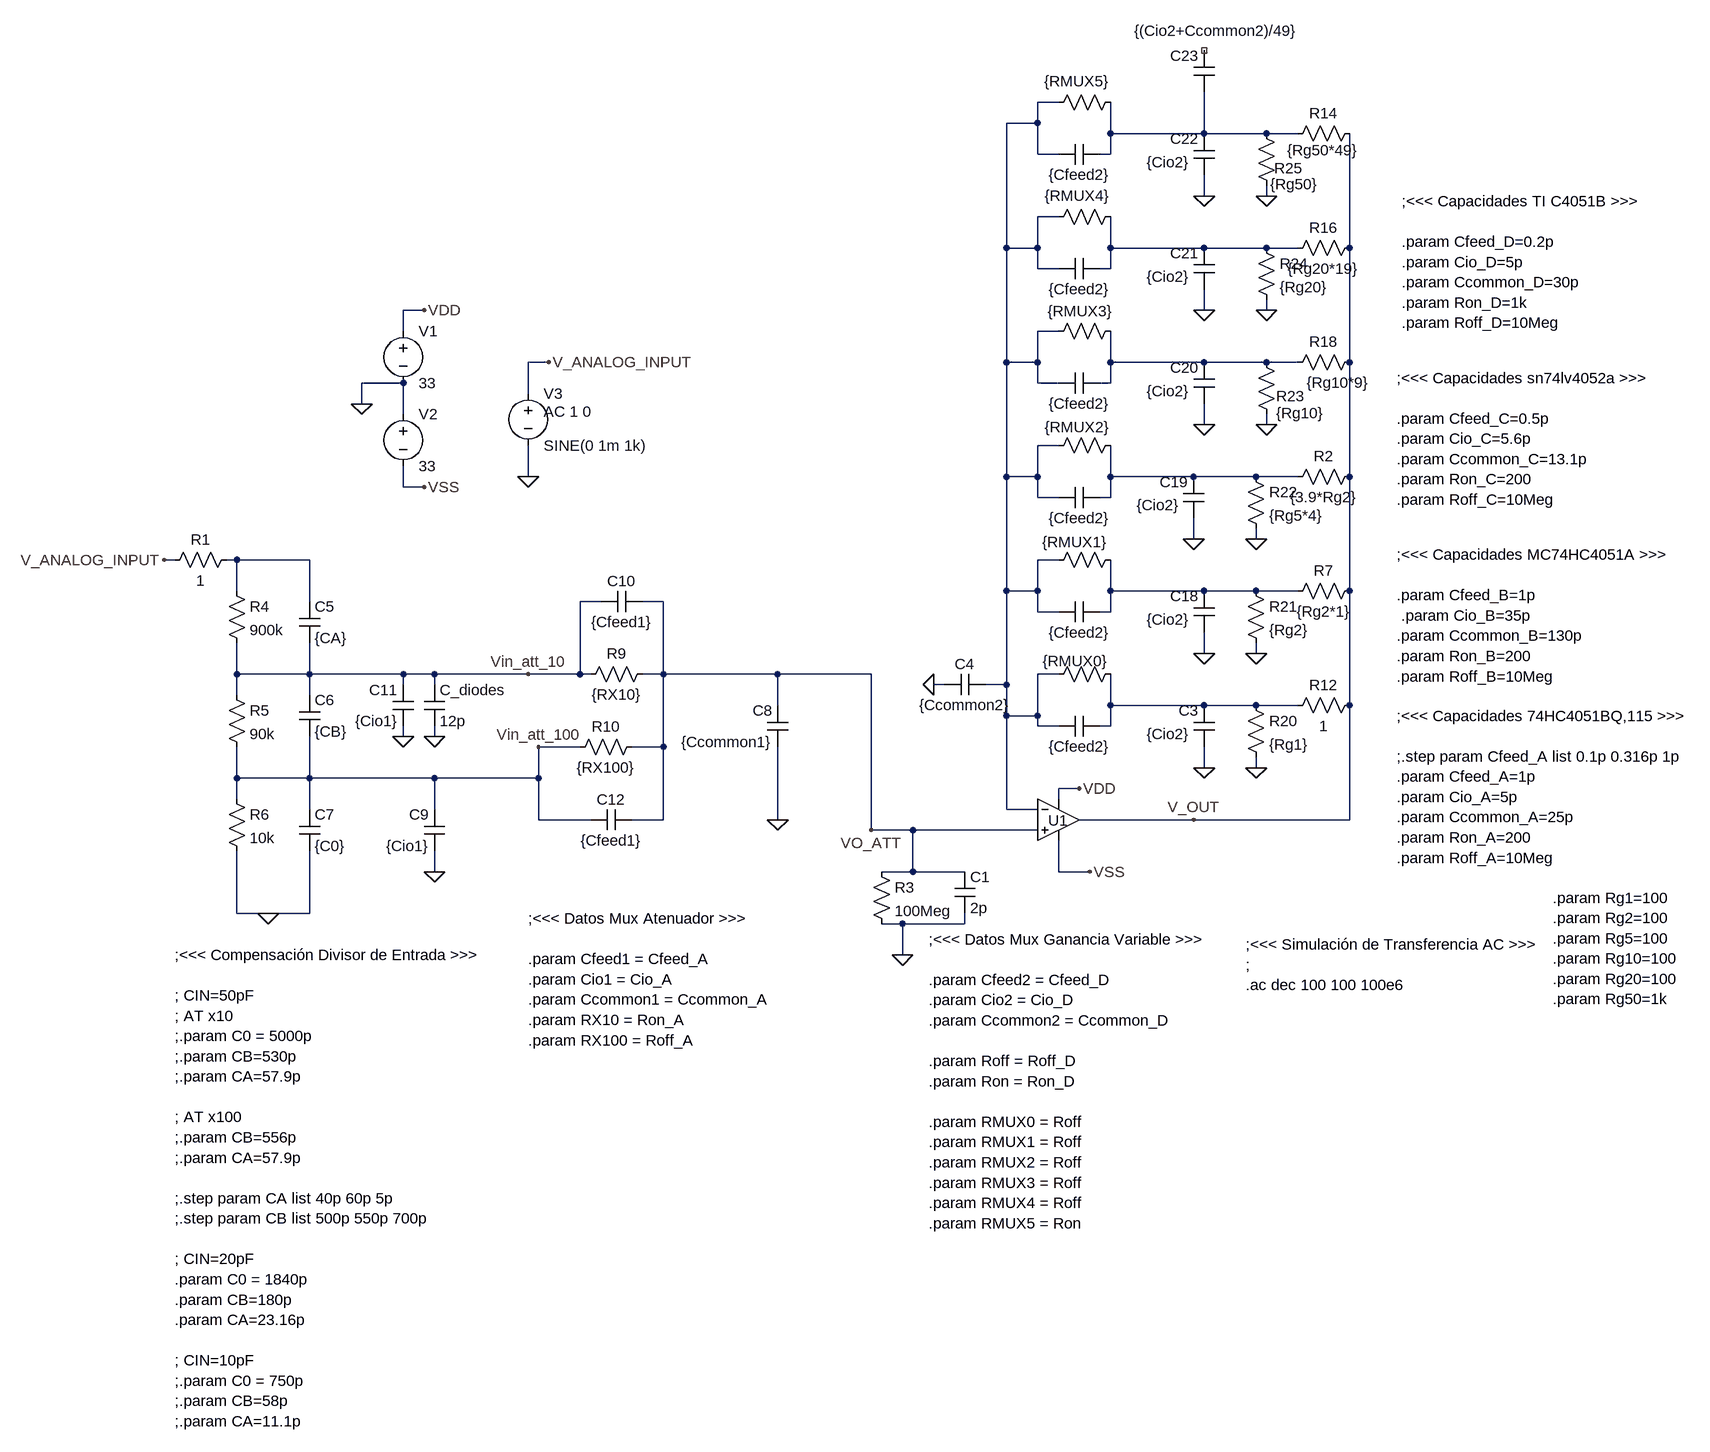
[diagram p0: schematic mux_sim_B.asc]
mux_sim_B.asc, the LTspice schematic file:
Version 4
SHEET 1 1156 1428
WIRE -32 -544 -64 -544
WIRE -64 -512 -64 -544
WIRE -64 -512 -112 -512
WIRE 48 -496 48 -544
WIRE 192 -496 192 -560
WIRE 192 -496 48 -496
WIRE 288 -496 192 -496
WIRE 336 -496 288 -496
WIRE -64 -464 -64 -512
WIRE -32 -464 -64 -464
WIRE 48 -464 48 -496
WIRE 48 -464 32 -464
WIRE 192 -400 192 -432
WIRE 288 -400 288 -416
WIRE -32 -368 -64 -368
WIRE -112 -320 -112 -512
WIRE -64 -320 -64 -368
WIRE -64 -320 -112 -320
WIRE 48 -320 48 -368
WIRE 192 -320 48 -320
WIRE 288 -320 192 -320
WIRE 336 -320 288 -320
WIRE 416 -320 416 -496
WIRE -64 -288 -64 -320
WIRE -32 -288 -64 -288
WIRE 48 -288 48 -320
WIRE 48 -288 32 -288
WIRE -1008 -224 -1040 -224
WIRE 192 -224 192 -256
WIRE 288 -224 288 -240
WIRE -1040 -192 -1040 -224
WIRE -32 -192 -64 -192
WIRE -816 -144 -848 -144
WIRE -112 -144 -112 -320
WIRE -64 -144 -64 -192
WIRE -64 -144 -112 -144
WIRE 48 -144 48 -192
WIRE 192 -144 48 -144
WIRE 288 -144 192 -144
WIRE 336 -144 288 -144
WIRE 416 -144 416 -320
WIRE -1040 -112 -1104 -112
WIRE -64 -112 -64 -144
WIRE -32 -112 -64 -112
WIRE 48 -112 48 -144
WIRE 48 -112 32 -112
WIRE -848 -96 -848 -144
WIRE -1104 -80 -1104 -112
WIRE -1040 -64 -1040 -112
WIRE 192 -48 192 -80
WIRE 288 -48 288 -64
WIRE -32 -16 -64 -16
WIRE -848 32 -848 -16
WIRE -112 32 -112 -144
WIRE -64 32 -64 -16
WIRE -64 32 -112 32
WIRE 48 32 48 -16
WIRE 176 32 48 32
WIRE 272 32 176 32
WIRE 336 32 272 32
WIRE 416 32 416 -144
WIRE -1040 48 -1040 16
WIRE -1008 48 -1040 48
WIRE -64 64 -64 32
WIRE -32 64 -64 64
WIRE 48 64 48 32
WIRE 48 64 32 64
WIRE 176 128 176 96
WIRE 272 128 272 112
WIRE -1392 160 -1408 160
WIRE -1296 160 -1312 160
WIRE -1184 160 -1296 160
WIRE -32 160 -64 160
WIRE -1296 208 -1296 160
WIRE -112 208 -112 32
WIRE -64 208 -64 160
WIRE -64 208 -112 208
WIRE 48 208 48 160
WIRE 192 208 48 208
WIRE 272 208 192 208
WIRE 336 208 272 208
WIRE 416 208 416 32
WIRE -1184 224 -1184 160
WIRE -736 224 -768 224
WIRE -640 224 -672 224
WIRE -64 240 -64 208
WIRE -32 240 -64 240
WIRE 48 240 48 208
WIRE 48 240 32 240
WIRE 192 304 192 272
WIRE 272 304 272 288
WIRE -1296 336 -1296 288
WIRE -1184 336 -1184 288
WIRE -1184 336 -1296 336
WIRE -1040 336 -1184 336
WIRE -992 336 -1040 336
WIRE -848 336 -992 336
WIRE -768 336 -768 224
WIRE -768 336 -848 336
WIRE -752 336 -768 336
WIRE -640 336 -640 224
WIRE -640 336 -672 336
WIRE -464 336 -640 336
WIRE -320 336 -464 336
WIRE -32 336 -64 336
WIRE -1040 352 -1040 336
WIRE -992 352 -992 336
WIRE -208 352 -224 352
WIRE -112 352 -112 208
WIRE -112 352 -144 352
WIRE -1296 368 -1296 336
WIRE -1184 368 -1184 336
WIRE -464 384 -464 336
WIRE 48 384 48 336
WIRE 192 384 48 384
WIRE 272 384 192 384
WIRE 336 384 272 384
WIRE 416 384 416 208
WIRE -112 400 -112 352
WIRE -64 400 -64 336
WIRE -64 400 -112 400
WIRE -64 416 -64 400
WIRE -32 416 -64 416
WIRE 48 416 48 384
WIRE 48 416 32 416
WIRE -1040 432 -1040 416
WIRE -992 432 -992 416
WIRE -768 448 -832 448
WIRE -640 448 -640 336
WIRE -640 448 -688 448
WIRE 192 480 192 448
WIRE 272 480 272 464
WIRE -1296 496 -1296 448
WIRE -1184 496 -1184 432
WIRE -1184 496 -1296 496
WIRE -992 496 -1184 496
WIRE -832 496 -832 448
WIRE -832 496 -992 496
WIRE 0 512 -32 512
WIRE -1296 528 -1296 496
WIRE -32 528 -32 512
WIRE -1184 544 -1184 496
WIRE -992 544 -992 496
WIRE -112 544 -112 400
WIRE -64 544 -112 544
WIRE -832 560 -832 496
WIRE -752 560 -832 560
WIRE -640 560 -640 448
WIRE -640 560 -688 560
WIRE -464 560 -464 448
WIRE 176 560 0 560
WIRE 416 560 416 384
WIRE 416 560 176 560
WIRE -320 576 -320 336
WIRE -256 576 -320 576
WIRE -64 576 -256 576
WIRE -992 640 -992 608
WIRE -256 640 -256 576
WIRE -256 640 -304 640
WIRE -176 640 -256 640
WIRE -32 640 -32 592
WIRE 16 640 -32 640
WIRE -1296 704 -1296 608
WIRE -1248 704 -1296 704
WIRE -1184 704 -1184 608
WIRE -1184 704 -1248 704
WIRE -272 720 -304 720
WIRE -176 720 -176 704
WIRE -176 720 -272 720
WIRE -272 768 -272 720
FLAG 16 640 VSS
FLAG -272 768 0
FLAG 272 480 0
FLAG 0 512 VDD
FLAG -1104 -80 0
FLAG -1008 -224 VDD
FLAG -1008 48 VSS
FLAG -816 -144 V_ANALOG_INPUT
FLAG -848 32 0
FLAG 176 560 V_OUT
FLAG -224 352 0
FLAG 192 480 0
FLAG -1248 704 0
FLAG -1408 160 V_ANALOG_INPUT
FLAG -464 560 0
FLAG -1040 432 0
FLAG -848 336 Vin_att_10
FLAG -832 448 Vin_att_100
FLAG -992 640 0
FLAG -320 576 VO_ATT
FLAG -992 432 0
FLAG 272 304 0
FLAG 272 128 0
FLAG 288 -48 0
FLAG 288 -224 0
FLAG 288 -400 0
FLAG 192 304 0
FLAG 176 128 0
FLAG 192 -48 0
FLAG 192 -224 0
FLAG 192 -400 0
SYMBOL res 432 16 R90
WINDOW 0 0 56 VBottom 2
WINDOW 3 32 56 VTop 2
SYMATTR InstName R2
SYMATTR Value {3.9*Rg2}
SYMBOL cap -192 640 R0
SYMATTR InstName C1
SYMATTR Value 2p
SYMBOL res -320 624 R0
SYMATTR InstName R3
SYMATTR Value 100Meg
SYMBOL voltage -1040 -208 R0
WINDOW 123 0 0 Left 2
WINDOW 39 0 0 Left 2
SYMATTR InstName V1
SYMATTR Value 33
SYMBOL voltage -1040 -80 R0
WINDOW 123 0 0 Left 2
WINDOW 39 0 0 Left 2
SYMATTR InstName V2
SYMATTR Value 33
SYMBOL voltage -848 -112 R0
WINDOW 123 24 44 Left 2
WINDOW 39 0 0 Left 2
SYMATTR Value2 AC 1 0
SYMATTR InstName V3
SYMATTR Value SINE(0 1m 1k)
SYMBOL Opamps\\UniversalOpamp2 -32 560 R0
WINDOW 0 -16 1 Left 2
SYMATTR InstName U1
SYMATTR Value2 Avol=40k GBW=250Meg Slew=100Meg
SYMBOL cap 32 48 R90
WINDOW 0 0 32 Invisible 2
WINDOW 3 32 32 VTop 2
SYMATTR InstName C2
SYMATTR Value {Cfeed2}
SYMBOL cap -144 336 R90
WINDOW 0 0 32 VBottom 2
WINDOW 3 32 32 VTop 2
SYMATTR InstName C4
SYMATTR Value {Ccommon2}
SYMBOL cap 208 448 R180
WINDOW 0 24 56 Left 2
WINDOW 3 38 20 Left 2
SYMATTR InstName C3
SYMATTR Value {Cio2}
SYMBOL res -1312 192 R0
SYMATTR InstName R4
SYMATTR Value 900k
SYMBOL res -1312 352 R0
SYMATTR InstName R5
SYMATTR Value 90k
SYMBOL res -1312 512 R0
SYMATTR InstName R6
SYMATTR Value 10k
SYMBOL cap -1200 224 R0
SYMATTR InstName C5
SYMATTR Value {CA}
SYMBOL cap -1200 368 R0
SYMATTR InstName C6
SYMATTR Value {CB}
SYMBOL cap -1200 544 R0
SYMATTR InstName C7
SYMATTR Value {C0}
SYMBOL res 64 -32 R90
WINDOW 0 0 56 Invisible 2
WINDOW 3 -28 67 VTop 2
SYMATTR InstName R8
SYMATTR Value {RMUX2}
SYMBOL cap -448 448 R180
WINDOW 0 24 56 Left 2
WINDOW 3 24 8 Left 2
SYMATTR InstName C8
SYMATTR Value {Ccommon1}
SYMBOL cap -672 208 R90
WINDOW 0 0 32 VBottom 2
WINDOW 3 32 32 VTop 2
SYMATTR InstName C10
SYMATTR Value {Cfeed1}
SYMBOL cap -1024 416 R180
WINDOW 0 24 56 Left 2
WINDOW 3 24 8 Left 2
SYMATTR InstName C11
SYMATTR Value {Cio1}
SYMBOL cap -976 608 R180
WINDOW 0 24 56 Left 2
WINDOW 3 24 8 Left 2
SYMATTR InstName C9
SYMATTR Value {Cio1}
SYMBOL res -656 320 R90
WINDOW 0 0 56 VBottom 2
WINDOW 3 32 56 VTop 2
SYMATTR InstName R9
SYMATTR Value {RX10}
SYMBOL res -672 432 R90
WINDOW 0 0 56 VBottom 2
WINDOW 3 32 56 VTop 2
SYMATTR InstName R10
SYMATTR Value {RX100}
SYMBOL cap -688 544 R90
WINDOW 0 0 32 VBottom 2
WINDOW 3 32 32 VTop 2
SYMATTR InstName C12
SYMATTR Value {Cfeed1}
SYMBOL res 432 192 R90
WINDOW 0 0 56 VBottom 2
WINDOW 3 32 56 VTop 2
SYMATTR InstName R7
SYMATTR Value {Rg2*1}
SYMBOL cap 32 224 R90
WINDOW 0 0 32 Invisible 2
WINDOW 3 32 32 VTop 2
SYMATTR InstName C13
SYMATTR Value {Cfeed2}
SYMBOL res 64 144 R90
WINDOW 0 0 56 Invisible 2
WINDOW 3 -27 71 VTop 2
SYMATTR InstName R11
SYMATTR Value {RMUX1}
SYMBOL res 432 368 R90
WINDOW 0 0 56 VBottom 2
WINDOW 3 32 56 VTop 2
SYMATTR InstName R12
SYMATTR Value 1
SYMBOL cap 32 400 R90
WINDOW 0 0 32 Invisible 2
WINDOW 3 32 32 VTop 2
SYMATTR InstName C14
SYMATTR Value {Cfeed2}
SYMBOL res 64 320 R90
WINDOW 0 0 56 Invisible 2
WINDOW 3 -20 70 VTop 2
SYMATTR InstName R13
SYMATTR Value {RMUX0}
SYMBOL res 432 -512 R90
WINDOW 0 0 56 VBottom 2
WINDOW 3 26 57 VTop 2
SYMATTR InstName R14
SYMATTR Value {Rg50*49}
SYMBOL cap 32 -480 R90
WINDOW 0 0 32 Invisible 2
WINDOW 3 32 32 VTop 2
SYMATTR InstName C15
SYMATTR Value {Cfeed2}
SYMBOL res 64 -560 R90
WINDOW 0 0 56 Invisible 2
WINDOW 3 -32 68 VTop 2
SYMATTR InstName R15
SYMATTR Value {RMUX5}
SYMBOL res 432 -336 R90
WINDOW 0 0 56 VBottom 2
WINDOW 3 32 56 VTop 2
SYMATTR InstName R16
SYMATTR Value {Rg20*19}
SYMBOL cap 32 -304 R90
WINDOW 0 0 32 Invisible 2
WINDOW 3 32 32 VTop 2
SYMATTR InstName C16
SYMATTR Value {Cfeed2}
SYMBOL res 64 -384 R90
WINDOW 0 0 56 Invisible 2
WINDOW 3 -32 67 VTop 2
SYMATTR InstName R17
SYMATTR Value {RMUX4}
SYMBOL res 432 -160 R90
WINDOW 0 0 56 VBottom 2
WINDOW 3 32 34 VTop 2
SYMATTR InstName R18
SYMATTR Value {Rg10*9}
SYMBOL cap 32 -128 R90
WINDOW 0 0 32 Invisible 2
WINDOW 3 32 32 VTop 2
SYMATTR InstName C17
SYMATTR Value {Cfeed2}
SYMBOL res 64 -208 R90
WINDOW 0 0 56 Invisible 2
WINDOW 3 -30 62 VTop 2
SYMATTR InstName R19
SYMATTR Value {RMUX3}
SYMBOL cap -1008 352 R0
SYMATTR InstName C_diodes
SYMATTR Value 12p
SYMBOL res 256 368 R0
SYMATTR InstName R20
SYMATTR Value {Rg1}
SYMBOL res 256 192 R0
SYMATTR InstName R21
SYMATTR Value {Rg2}
SYMBOL res 256 16 R0
SYMATTR InstName R22
SYMATTR Value {Rg5*4}
SYMBOL res 272 -160 R0
WINDOW 0 31 68 Left 2
WINDOW 3 31 94 Left 2
SYMATTR InstName R23
SYMATTR Value {Rg10}
SYMBOL res 272 -336 R0
SYMATTR InstName R24
SYMATTR Value {Rg20}
SYMBOL res 272 -512 R0
WINDOW 0 28 69 Left 2
WINDOW 3 22 94 Left 2
SYMATTR InstName R25
SYMATTR Value {Rg50}
SYMBOL cap 208 272 R180
WINDOW 0 24 56 Left 2
WINDOW 3 38 20 Left 2
SYMATTR InstName C18
SYMATTR Value {Cio2}
SYMBOL cap 192 96 R180
WINDOW 0 24 56 Left 2
WINDOW 3 38 20 Left 2
SYMATTR InstName C19
SYMATTR Value {Cio2}
SYMBOL cap 208 -80 R180
WINDOW 0 24 56 Left 2
WINDOW 3 38 20 Left 2
SYMATTR InstName C20
SYMATTR Value {Cio2}
SYMBOL cap 208 -256 R180
WINDOW 0 24 56 Left 2
WINDOW 3 38 20 Left 2
SYMATTR InstName C21
SYMATTR Value {Cio2}
SYMBOL cap 208 -432 R180
WINDOW 0 24 56 Left 2
WINDOW 3 38 20 Left 2
SYMATTR InstName C22
SYMATTR Value {Cio2}
SYMBOL cap 208 -560 R180
WINDOW 0 24 56 Left 2
WINDOW 3 -131 94 Left 2
SYMATTR InstName C23
SYMATTR Value {(Cio2+Ccommon2)/49}
SYMBOL res -1296 144 R90
WINDOW 0 0 56 VBottom 2
WINDOW 3 32 56 VTop 2
SYMATTR InstName R1
SYMATTR Value 1
TEXT 488 -120 Left 2 !;<<< Capacidades sn74lv4052a >>>\n \n.param Cfeed_C=0.5p\n.param Cio_C=5.6p\n.param Ccommon_C=13.1p\n.param Ron_C=200\n.param Roff_C=10Meg
TEXT -848 712 Left 2 !;<<< Datos Mux Atenuador >>>\n \n.param Cfeed1 = Cfeed_A\n.param Cio1 = Cio_A\n.param Ccommon1 = Ccommon_A\n.param RX10 = Ron_A\n.param RX100 = Roff_A
TEXT 488 152 Left 2 !;<<< Capacidades MC74HC4051A >>>\n \n.param Cfeed_B=1p\n .param Cio_B=35p\n.param Ccommon_B=130p\n.param Ron_B=200\n.param Roff_B=10Meg
TEXT -232 744 Left 2 !;<<< Datos Mux Ganancia Variable >>>\n \n.param Cfeed2 = Cfeed_D\n.param Cio2 = Cio_D\n.param Ccommon2 = Ccommon_D\n \n.param Roff = Roff_D\n.param Ron = Ron_D \n \n.param RMUX0 = Roff\n.param RMUX1 = Roff\n.param RMUX2 = Roff\n.param RMUX3 = Roff\n.param RMUX4 = Roff\n.param RMUX5 = Ron
TEXT 256 752 Left 2 !;<<< Simulación de Transferencia AC >>>\n;\n.ac dec 100 100 100e6
TEXT 488 400 Left 2 !;<<< Capacidades 74HC4051BQ,115 >>>\n \n;.step param Cfeed_A list 0.1p 0.316p 1p\n.param Cfeed_A=1p\n.param Cio_A=5p\n.param Ccommon_A=25p\n.param Ron_A=200\n.param Roff_A=10Meg
TEXT 496 -392 Left 2 !;<<< Capacidades TI C4051B >>>\n \n.param Cfeed_D=0.2p\n.param Cio_D=5p\n.param Ccommon_D=30p\n.param Ron_D=1k\n.param Roff_D=10Meg
TEXT 728 680 Left 2 !.param Rg1=100\n.param Rg2=100\n.param Rg5=100\n.param Rg10=100\n.param Rg20=100\n.param Rg50=1k
TEXT -1392 768 Left 2 !;<<< Compensación Divisor de Entrada >>>\n \n; CIN=50pF\n; AT x10\n;.param C0 = 5000p\n;.param CB=530p\n;.param CA=57.9p\n \n; AT x100\n;.param CB=556p\n;.param CA=57.9p\n \n;.step param CA list 40p 60p 5p\n;.step param CB list 500p 550p 700p\n \n; CIN=20pF\n.param C0 = 1840p\n.param CB=180p\n.param CA=23.16p\n \n; CIN=10pF\n;.param C0 = 750p\n;.param CB=58p\n;.param CA=11.1p

The netlist it stands for:
* mux_sim_B.asc
R2 V_OUT N005 {3.9*Rg2}
C1 VO_ATT 0 2p
R3 VO_ATT 0 100Meg
V1 VDD 0 33
V2 0 VSS 33
V3 V_ANALOG_INPUT 0 SINE(0 1m 1k) AC 1 0
XU1 VO_ATT N001 VDD VSS V_OUT level.2 Avol=40k GBW=250Meg Slew=100Meg ilimit=25m rail=0 Vos=0 phimargin=45 en=0 enk=0 in=0 ink=0 Rin=500Meg  ; pins IN+ IN- V+ V- OUT
C2 N005 N001 {Cfeed2}
C4 N001 0 {Ccommon2}
C3 0 N008 {Cio2}
R4 N006 Vin_att_10 900k
R5 Vin_att_10 Vin_att_100 90k
R6 Vin_att_100 0 10k
C5 N006 Vin_att_10 {CA}
C6 Vin_att_10 Vin_att_100 {CB}
C7 Vin_att_100 0 {C0}
R8 N005 N001 {RMUX2}
C8 0 VO_ATT {Ccommon1}
C10 VO_ATT Vin_att_10 {Cfeed1}
C11 0 Vin_att_10 {Cio1}
C9 0 Vin_att_100 {Cio1}
R9 VO_ATT Vin_att_10 {RX10}
R10 VO_ATT Vin_att_100 {RX100}
C12 VO_ATT Vin_att_100 {Cfeed1}
R7 V_OUT N007 {Rg2*1}
C13 N007 N001 {Cfeed2}
R11 N007 N001 {RMUX1}
R12 V_OUT N008 1
C14 N008 N001 {Cfeed2}
R13 N008 N001 {RMUX0}
R14 V_OUT N002 {Rg50*49}
C15 N002 N001 {Cfeed2}
R15 N002 N001 {RMUX5}
R16 V_OUT N003 {Rg20*19}
C16 N003 N001 {Cfeed2}
R17 N003 N001 {RMUX4}
R18 V_OUT N004 {Rg10*9}
C17 N004 N001 {Cfeed2}
R19 N004 N001 {RMUX3}
C_diodes Vin_att_10 0 12p
R20 N008 0 {Rg1}
R21 N007 0 {Rg2}
R22 N005 0 {Rg5*4}
R23 N004 0 {Rg10}
R24 N003 0 {Rg20}
R25 N002 0 {Rg50}
C18 0 N007 {Cio2}
C19 0 N005 {Cio2}
C20 0 N004 {Cio2}
C21 0 N003 {Cio2}
C22 0 N002 {Cio2}
C23 N002 NC_01 {(Cio2+Ccommon2)/49}
R1 N006 V_ANALOG_INPUT 1
;<<< Capacidades sn74lv4052a >>>
.param Cfeed_C=0.5p
.param Cio_C=5.6p
.param Ccommon_C=13.1p
.param Ron_C=200
.param Roff_C=10Meg
;<<< Datos Mux Atenuador >>>
.param Cfeed1 = Cfeed_A
.param Cio1 = Cio_A
.param Ccommon1 = Ccommon_A
.param RX10 = Ron_A
.param RX100 = Roff_A
;<<< Capacidades MC74HC4051A >>>
.param Cfeed_B=1p
 .param Cio_B=35p
.param Ccommon_B=130p
.param Ron_B=200
.param Roff_B=10Meg
;<<< Datos Mux Ganancia Variable >>>
.param Cfeed2 = Cfeed_D
.param Cio2 = Cio_D
.param Ccommon2 = Ccommon_D
.param Roff = Roff_D
.param Ron = Ron_D
.param RMUX0 = Roff
.param RMUX1 = Roff
.param RMUX2 = Roff
.param RMUX3 = Roff
.param RMUX4 = Roff
.param RMUX5 = Ron
;<<< Simulación de Transferencia AC >>>
;
.ac dec 100 100 100e6
;<<< Capacidades 74HC4051BQ,115 >>>
;.step param Cfeed_A list 0.1p 0.316p 1p
.param Cfeed_A=1p
.param Cio_A=5p
.param Ccommon_A=25p
.param Ron_A=200
.param Roff_A=10Meg
;<<< Capacidades TI C4051B >>>
.param Cfeed_D=0.2p
.param Cio_D=5p
.param Ccommon_D=30p
.param Ron_D=1k
.param Roff_D=10Meg
.param Rg1=100
.param Rg2=100
.param Rg5=100
.param Rg10=100
.param Rg20=100
.param Rg50=1k
;<<< Compensación Divisor de Entrada >>>
; CIN=50pF
; AT x10
;.param C0 = 5000p
;.param CB=530p
;.param CA=57.9p
; AT x100
;.param CB=556p
;.param CA=57.9p
;.step param CA list 40p 60p 5p
;.step param CB list 500p 550p 700p
; CIN=20pF
.param C0 = 1840p
.param CB=180p
.param CA=23.16p
; CIN=10pF
;.param C0 = 750p
;.param CB=58p
;.param CA=11.1p
.lib UniversalOpamps2.sub
.backanno
.end